# EAGLE schematic LCDserie (EAGLE 6.1)
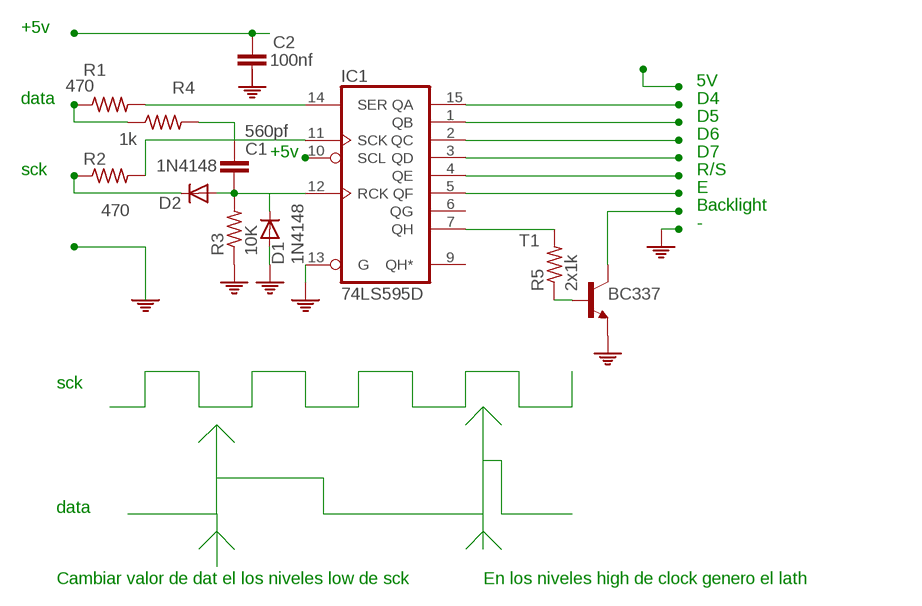
[diagram p0: schematic, sheet 1]

## Parts
C1  560pf  C-EU025_050-035X075  [C025_050-035X075]
C2  100nf  C-EU025_050-035X075  [C025_050-035X075]
D1  1N4148  1N4148DO35-7  [DO35-7]
D2  1N4148  1N4148DO35-7  [DO35-7]
IC1  74LS595D  [SO16]
R1  470  R-US_0207/7  [0207/7]
R2  470  R-US_0207/7  [0207/7]
R3  10K  R-US_0207/7  [0207/7]
R4  1k  R-US_0207/7  [0207/7]
R5  2x1k  R-US_0207/7  [0207/7]
T1  BC337  [TO92]

## Nets
N$1: C2.2
N$2: IC1.14(SER) R1.2
N$3: R1.1 R4.1
N$4: D2.C R2.1
N$5: IC1.11(SCK) R2.2
N$6: C1.2 D1.C D2.A IC1.12(RCK) R3.2
N$7: C1.1 R4.2
N$8: IC1.7(QH) R5.2
N$9: R5.1 T1.2(B)
N$10: T1.3(C)
N$11: IC1.15(QA)
N$12: IC1.1(QB)
N$13: IC1.2(QC)
N$14: IC1.3(QD)
N$15: IC1.4(QE)
N$20: IC1.5(QF)
N$21: IC1.10(SCL)
PE: D1.A IC1.13(G) R3.1 T1.1(E)
Unconnected: C2.1 IC1.6(QG) IC1.9(QH*)

## Notes on the sheet
- +5v
- 5V
- data | D4
- D5
- D6
- +5v | D7
- sck | R/S
- E
- Backlight
- -
- sck
- data
- Cambiar valor de dat el los niveles low de sck | En los niveles high de clock genero el lath

## Power pins joined to a net without a drawn wire
GND: IC1.8(GND)
VCC: IC1.16(VCC)

## Library data of the parts
C1 C2 = rcl:C-EU: CAPACITOR, European symbol
D1 D2 = diode:1N4148: DIODE high speed (Philips)
IC1 = 74xx-us:74*595: 8-bit SHIFT REGISTER, output latch
R1-R5 = resistor:R-US_: RESISTOR, American symbol
T1 = transistor:BC337: NPN TRANSISTOR